# Altium schematic sheet 48-17V Buck Converter.SchDoc: 48-17V Buck Converter
size B; CheckedBy: Logan Hartford; Engineer: Rayyan Mahmood; Organization: UW Robotics; Address1: 200 University Avenue; Address2: Waterloo; Address3: Ontario; Address4: Canada N2L 3G6; DocumentNumber: 1; Revision: 2.0; SheetNumber: 1; SheetTotal: 1
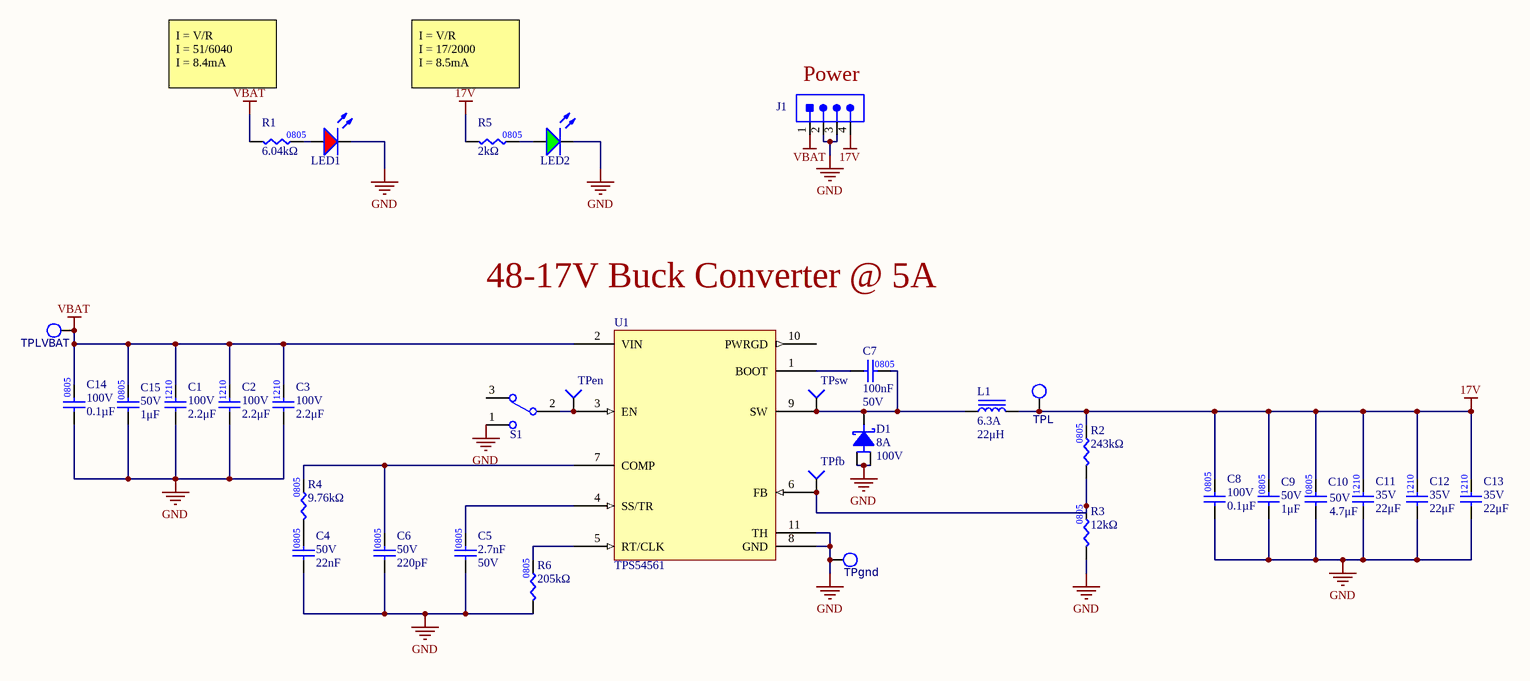
[diagram p0: 48-17V Buck Converter.SchDoc]

## Parts
C1  value 2.2μF  Voltage Rating: 100V  [CAPC3225X270N]  (hidden comment: CAP_2.2uF_100V_1210_1)
C2  value 2.2μF  Voltage Rating: 100V  [CAPC3225X270N]  (hidden comment: CAP_2.2uF_100V_1210_1)
C3  value 2.2μF  Voltage Rating: 100V  [CAPC3225X270N]  (hidden comment: CAP_2.2uF_100V_1210_1)
C4  value 22nF  Voltage Rating: 50V  [CAP2012]  (hidden comment: CAP_22nF_50V_0805 +/- 1%)
C5  value 2.7nF  Voltage Rating: 50V  [CAP0805]  (hidden comment: CAP_2.7nF_50V_0805)
C6  value 220pF  Voltage Rating: 50V  [CAP2012]  (hidden comment: CAP_220pF_50V_0805_2_1)
C7  value 100nF  Voltage Rating: 50V  [CAP0805]  (hidden comment: CAP_100nF_50V_0805)
C8  value 0.1µF  Voltage Rating: 100V  [CAP0805]  (hidden comment: CAP_0.1uF_100V_0805)
C9  value 1μF  Voltage Rating: 50V  [CAP2012]  (hidden comment: CAP_1uF_50V_0805)
C10  value 4.7μF  Voltage Rating: 50V  [CAP0805]  (hidden comment: CAP_4.7uF_50V_0805)
C11  value 22μF  Voltage Rating: 35V  [CAP1210]  (hidden comment: CAP_22uF_100V_1210)
C12  value 22μF  Voltage Rating: 35V  [CAP1210]  (hidden comment: CAP_22uF_100V_1210)
C13  value 22μF  Voltage Rating: 35V  [CAP1210]  (hidden comment: CAP_22uF_100V_1210)
C14  value 0.1µF  Voltage Rating: 100V  [CAP0805]  (hidden comment: CAP_0.1uF_100V_0805)
C15  value 1μF  Voltage Rating: 50V  [CAP2012]  (hidden comment: CAP_1uF_50V_0805)
D1  8A  Vr (Max): 100V  [TO-277]
J1  CON_2POS_SCREW_TERM  [MPT-04-01-01-L-RA-SD]  (value not drawn)
L1  Current Rating: 6.3A  Inductance: 22μH  [IND_22uH_6.3A]  (hidden comment: IND_22uH_6.3A)
LED1  LED_RED  [LED_0805_RED]  (value not drawn)
LED2  LED_GREEN  [LED_0805_GREEN]  (value not drawn)
R1  value 6.04kΩ  [RES0805]  (hidden comment: RES_6.04kΩ_0805_1%)
R2  value 243kΩ  [RES0805]  (hidden comment: RES_243kΩ_0805_1%_1)
R3  value 12kΩ  [RES0805]  (hidden comment: RES_12kΩ_0805_1%)
R4  value 9.76kΩ  [RES0805]  (hidden comment: RES_9.76kΩ_0805_1%)
R5  value 2kΩ  [RES0805]  (hidden comment: RES_2KΩ_0805_1%)
R6  value 205kΩ  [RES0805]  (hidden comment: RES_205kΩ_0805_1%)
S1  SW_SLIDE_TOGGLE  [SW_SLIDE_TOGGLE]  (value not drawn)
TPen  TESTPOINT_1MM_CIRCLE  [TESTPOINT_CIRCLE_1MM]  (value not drawn)  (no BOM)
TPfb  TESTPOINT_1MM_CIRCLE  [TESTPOINT_CIRCLE_1MM]  (value not drawn)  (no BOM)
TPgnd  TESTPOINT_LOOP  [TESTPOINT_LOOP]  (value not drawn)
TPL  TESTPOINT_LOOP  [TESTPOINT_LOOP]  (value not drawn)
TPLVBAT  TESTPOINT_LOOP  [TESTPOINT_LOOP]  (value not drawn)
TPsw  TESTPOINT_1MM_CIRCLE  [TESTPOINT_CIRCLE_1MM]  (value not drawn)  (no BOM)
U1  TPS54561  [BUCK_TPS54561DPRR]

## Nets
17V: C8.2 C9.2 C10.2 C11.2 C12.2 C13.2 J1.4 L1.2 R2.2 R5.1 TPL.1
GND: C1.1 C2.1 C3.1 C4.1 C5.1 C6.1 C8.1 C9.1 C10.1 C11.1 C12.1 C13.1 C14.1 C15.1 D1.1(Anode) D1.3 J1.2 J1.3 LED1.2(K) LED2.2(K) R3.1 R6.1 S1.1 TPgnd.1 U1.8(GND) U1.11(TH)
VBAT: C1.2 C2.2 C3.2 C14.2 C15.2 J1.1 R1.1 TPLVBAT.1 U1.2(VIN)
NetC4_2: C4.2 R4.1
NetC5_2: C5.2 U1.4(SS/TR)
NetC6_2: C6.2 R4.2 U1.7(COMP)
NetC7_1: C7.1 U1.1(BOOT)
NetC7_2: C7.2 D1.2(Cathode) L1.1 TPsw.1(=value) U1.9(SW)
NetLED1_1: LED1.1(A) R1.2
NetLED2_1: LED2.1(A) R5.2
NetR2_1: R2.1 R3.2 TPfb.1(=value) U1.6(FB)
NetR6_2: R6.2 U1.5(RT/CLK)
NetS1_2: S1.2 TPen.1(=value) U1.3(EN)

Not connected (* = marked no-connect by the designer): S1 3; U1 10(PWRGD)

## Notes on the sheet
- I = V/R
  I = 51/6040
  I = 8.4mA
- I = V/R
  I = 17/2000
  I = 8.5mA
- (near J1) Power
- 48-17V Buck Converter @ 5A
- (near U1) Double check footprint for this IC
- (near C7) PWRGD needed ONLY if a 5.5V or lower voltage source is connected
- Title:
- Project:
- Date:
- Rev:
- Reviewer:
- Engineer:
- Sheet:
- of

## Library data of the parts
C1-C3 = CAP_2.2uF_100V_1210_1: CAP CER 2.2UF 100V X7R 1210; Manufacturer 1: TDK Corporation; Manufacturer Part Number 1: C3225X7R2A225K230AB; Package/Footprint: 1210; Supplier 1: Digi-Key; Supplier Part Number 1: 445-4497-1-ND; Mounting Type: SMD
C4 = CAP_22nF_50V_0805 +/- 1%: CAP CER 22nF 50V 0805; Manufacturer Part Number 1: GCM21B5C1H223FA16L; Manufacturer 1: Murata Electronics; Supplier Part Number 1: 490-GCM21B5C1H223FA16LCT-ND; Supplier 1: Digi-Key; Mounting Type: SMD; Package: 0805
C5 = CAP_2.7nF_50V_0805: CAP CER 2700PF 50V C0G 0805; Manufacturer 1: TDK Corporation; Manufacturer Part Number 1: C2012C0G1H272J060AA; Package/Footprint: 0805; Supplier 1: Digi-Key; Supplier Part Number 1: 445-7508-1-ND
C6 = CAP_220pF_50V_0805_2_1: CAP CER 220pF 50V 0805 +/-1%; Manufacturer Part Number 1: CC0805FRNPO9BN221; Manufacturer 1: YAGEO; Supplier Part Number 1: 311-4172-1-ND; Supplier 1: Digi-Key; Mounting Type: SMD; Package: 0805
C7 = CAP_100nF_50V_0805: CAP CER 0.1UF 50V X7R 0805; Manufacturer 1: Samsung Electro-Mechanics; Manufacturer Part Number 1: CL21B104KBCNNNC; Package/Footprint: 0805; Supplier 1: Digi-Key; Supplier Part Number 1: 1276-1003-1-ND
C8 C14 = CAP_0.1uF_100V_0805: CAP CER 0.1UF 100V X7R 0805; Manufacturer 1: TDK Corporation; Manufacturer Part Number 1: C2012X7R2A104K125AA; Package: 0805; Supplier 1: Digi-Key; Supplier Part Number 1: 445-1418-1-ND
C9 C15 = CAP_1uF_50V_0805: CAP CER 1UF 50V X7R 0805; Manufacturer Part Number 1: CL21B105KBFNNNG; Manufacturer 1: Samsung Electro-Mechanics; Supplier Part Number 1: 1276-6470-1-ND; Supplier 1: Digi-Key; Mounting Type: SMD; LCSC Part #: C28323; Package: 0805
C10 = CAP_4.7uF_50V_0805: CAP CER 4.7UF 50V X5R 0805; Manufacturer 1: TDK Corporation; Manufacturer Part Number 1: CGA4J3X5R1H475K125AB; Mounting Type: SMD; Supplier 1: Digi-Key; Supplier Part Number 1: 445-7882-1-ND; Package: 0805; LCSC Part #: C1779; Dielectric: X5R
C11-C13 = CAP_22uF_100V_1210: CAP CER 22UF 35V X5R 1210; Manufacturer 1: Taiyo Yuden; Manufacturer Part Number 1: GMK325BJ226MM-T; Package/Footprint: 1210; Supplier 1: Digi-Key; Supplier Part Number 1: 587-6141-1-ND; Mounting Type: SMD
D1 = DIO_SCHOTTKY_100V_8A: Diode 100 V 8A Surface Mount TO-277; Manufacturer 1: GSGC151BS; Manufacturer Part Number 1: Good-Ark Semiconductor; Package/Footprint: T0-277; Mounting Type: SMD; Supplier 1: Digikey; Supplier Part Number 1: 4786-GSGC151BSTR-ND
J1 = CON_4POS_POWERBLADE_MALE: CONN HDR 4POS 5MM R/A SLDR; Manufacturer 1: Samtec Inc.; Package/Footprint: PowerStrip™ 30 MTS; Supplier 1: Digi-Key; Mounting Type: TH; Supplier Part Number 1: SAM9727-ND; Manufacturer Part Number 1: MPT-04-01-01-L-RA-SD
L1 = IND_22uH_6.3A: FIXED IND 22UH 6.3A 25.7MOHM SMD; Manufacturer 1: Eaton - Electronics Division; Manufacturer Part Number 1: HC9-220-R; DC Resistance (DCR): 22.27mR; Inductance Tolerance: 20%; Saturation Current: 11A; Supplier 1: Digi-Key; Supplier Part Number 1: 513-1349-1-ND; Mounting Type: SMD
LED1 = LED_RED: LED RED DIFFUSED 0805 SMD; Manufacturer 1: OSRAM; Manufacturer Part Number 1: LS R976-NR-1; Package/Footprint: 0805; Forward Voltage Drop: 2V; Supplier Part Number 1: 475-1278-1-ND; Supplier 1: Digi-Key; Mounting Type: SMD
LED2 = LED_GREEN: LED GREEN DIFFUSED 0805 SMD; Manufacturer 1: OSRAM; Manufacturer Part Number 1: LG R971-KN-1; Forward Voltage Drop: 2.2V; Package/Footprint: 0805; Supplier Part Number 1: 475-1410-1-ND; Supplier 1: Digi-Key; Mounting Type: SMD
R1 = RES_6.04kΩ_0805_1%: RES 6.04K OHM 1% 1/8W 0805; Manufacturer 1: Yageo; Manufacturer Part Number 1: RC0805FR-076K04L; Package/Footprint: 0805; Mounting Type: SMD; Supplier 1: Digi-Key; Supplier Part Number 1: 311-6.04KCRCT-ND
R2 = RES_243kΩ_0805_1%_1: RES 243K OHM 1% 1/8W 0805; Manufacturer 1: YAGEO; Manufacturer Part Number 1: RC0805FR-07243KL; Package/Footprint: 0805; Supplier Part Number 1: 311-243KCRCT-ND; Supplier 1: Digi-Key; Mounting Type: SMD
R3 = RES_12kΩ_0805_1%: RES 12K OHM 1% 1/8W 0805; Manufacturer 1: YAGEO; Manufacturer Part Number 1: RC0805FR-0712KL; Package/Footprint: 0805; Supplier Part Number 1: 311-12.0KCRCT-ND; Supplier 1: Digi-Key; Mounting Type: SMD
R4 = RES_9.76kΩ_0805_1%: RES 9.76K OHM 1% 1/8W 0805; Manufacturer 1: YAGEO; Manufacturer Part Number 1: RC0805FR-079K76L; Package/Footprint: 0805; Supplier Part Number 1: 311-9.76KCRCT-ND; Supplier 1: Digi-Key; Mounting Type: SMD
R5 = RES_2KΩ_0805_1%: RES 2K OHM 1% 1/8W 0805; Manufacturer 1: YAGEO; Manufacturer Part Number 1: CRCW08052K20JNEAC; Supplier 1: Digi-Key; Supplier Part Number 1: 13-RC0805FR-132KLCT-ND; Tolerance: 1%; Package: 0805
R6 = RES_205kΩ_0805_1%: RES 205K OHM 1% 1/8W 0805; Manufacturer 1: YAGEO; Manufacturer Part Number 1: RC0805FR-07205KL; Package/Footprint: 0805; Supplier Part Number 1: 311-205KCRCT-ND; Supplier 1: Digi-Key; Mounting Type: SMD
S1 = SW_SLIDE_TOGGLE: SWITCH SLIDE SPDT 200MA 30V; Manufacturer 1: E-Switch; Manufacturer Part Number 1: 100SP1T1B4M2QE; Package/Footprint: TH; Supplier 1: Digi-Key; Mounting Type: TH; Voltage Rating (DC): 30V; Throw Configuration: SPDT; Supplier Part Number 1: EG1903-ND
TPen TPfb TPsw = TESTPOINT_1MM_CIRCLE: TESTPOINT 1MM CIRCLE
TPgnd TPL TPLVBAT = TESTPOINT_LOOP: TESTPOINT THRUHOLE; Manufacturer 1: Keystone Electronics; Manufacturer Part Number 1: 5002; Package/Footprint: TH; Supplier Part Number 1: 36-5002-ND; Supplier 1: Digi-Key; Mounting Type: TH
U1 = TPS54561: Buck Switching Regulator IC Positive Adjustable 0.8V 1 Output 5A 10-WDFN Exposed Pad; Manufacturer 1: Texas Instruments; Manufacturer Part Number 1: TPS54561DPRR; Supplier 1: Digi-Key; Supplier Part Number 1: 296-40803-1-ND; Package/Footprint: 10-WDFN Exposed Pad; Mounting Type: SMD